# EAGLE design msp430-cc2500_breakout (EAGLE 6.1)
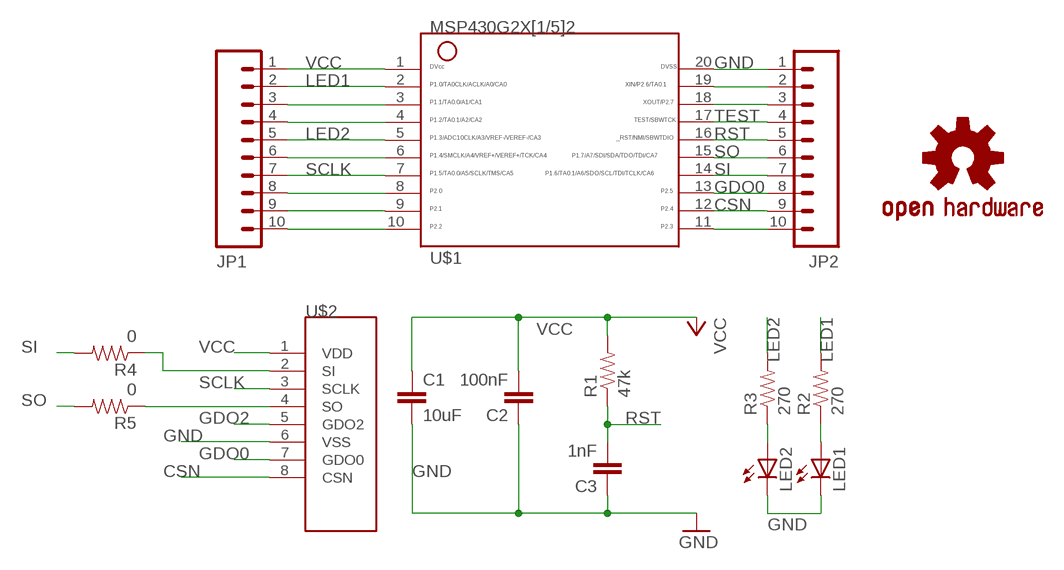
[diagram p0: schematic, sheet 1]

## Parts
C1  10uF  CAP0805  [0805]
C2  100nF  CAP0805  [0805]
C3  1nF  CAP0805  [0805]
JP1  M10"  [1X10]
JP2  M10"  [1X10]
LED1  LED1206  [LED-1206]
LED2  LED1206  [LED-1206]
R1  47k  RESISTOR0805-RES  [0805]
R2  270  RESISTOR0805-RES  [0805]
R3  270  RESISTOR0805-RES  [0805]
R4  0  RESISTOR0805-RES  [0805]
R5  0  RESISTOR0805-RES  [0805]
U$1  G2X[1/5]2---PW20  [PW20]
U$2  CC2500-MODULESMT  [CC2500-MODULE-SMT]
U$3  OSHW-LOGOL  [OSHW-LOGO-L]

## Nets
CSN: JP2.9 U$1.12 U$2.8(CSN)
GDO0: JP2.8 U$1.13 U$2.7(GDO0)
GDO2: U$2.5(GDO2)
GND: C1.2 C2.1 C3.1 JP2.1 LED1.C LED2.C U$1.20 U$2.6(VSS)
LED1: JP1.2 R2.2 U$1.2
LED2: JP1.5 R3.2 U$1.5
N$1: LED1.A R2.1
N$2: JP1.3 U$1.3
N$3: JP1.4 U$1.4
N$4: JP1.6 U$1.6
N$5: LED2.A R3.1
N$6: JP1.8 U$1.8
N$7: JP1.9 U$1.9
N$8: JP1.10 U$1.10
N$9: JP2.2 U$1.19
N$10: JP2.3 U$1.18
N$11: JP2.10 U$1.11
N$12: R4.1 U$2.2(SI)
N$13: R5.1 U$2.4(SO)
RST: C3.2 JP2.5 R1.1 U$1.16
SCLK: JP1.7 U$1.7 U$2.3(SCLK)
SI: JP2.7 R4.2 U$1.14
SO: JP2.6 R5.2 U$1.15
TEST: JP2.4 U$1.17
VCC: C1.1 C2.2 JP1.1 R1.2 U$1.1 U$2.1(VDD)

## Library data of the parts
C1-C3 = SparkFun:CAP: Capacitor Standard 0603 ceramic capacitor, and 0.1" leaded capacitor.
JP1 JP2 = SparkFun:M10: Header 10 Standard 10-pin 0.1" header. Use with straight break away headers (SKU : PRT-00116), right angle break away headers (PRT-00553), swiss pins (PRT-00743), machine pins (PRT-00117), and female headers (PRT-00115).
LED1 LED2 = SparkFun:LED: LEDs Standard schematic elements and footprints for 5mm, 3mm, 1206, and 0603 sized LEDs. 5mm - Spark Fun Electronics SKU : COM-00529 (and others)
R1-R5 = SparkFun:RESISTOR: Resistor Basic schematic elements and footprints for 0603, 1206, and PTH resistors.
U$1 = TI_MSP430_v16:G2X[1/5]2---PW20: MSP430G2X[1/5]2 MSP430G2x52, MSP430G2x12 TSSOP (PW) 20 Pin Package http://focus.ti.com/docs/prod/folders/print/msp430g2452.html
U$2 = alvaro:CC2500-MODULE
U$3 = SparkFun:OSHW-LOGO: Open Source Hardware Logo This logo indicates the piece of hardware it is found on incorporates a OSHW license and/or adheres to the definition of open source hardware found here: http://freedomdefined.org/OSHW

## Board
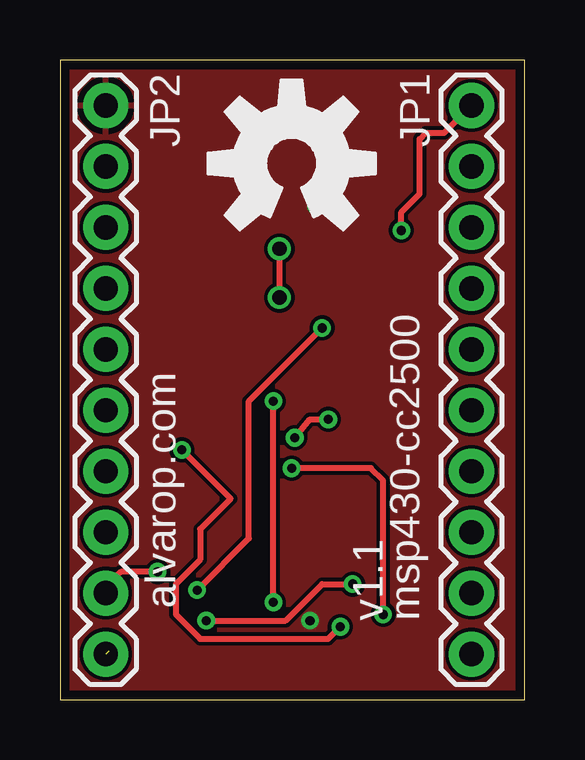
[diagram p1: board, top side]
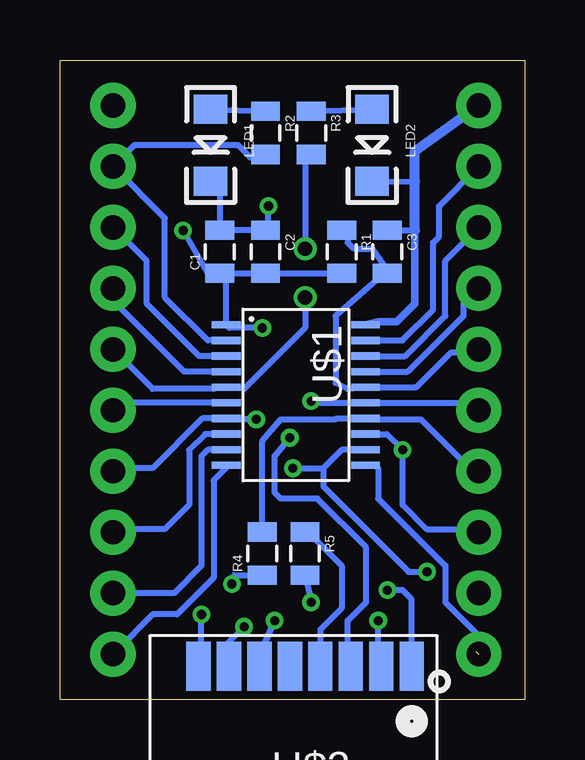
[diagram p2: board, bottom side, seen from below]

Size 19.36 x 26.66 mm. Coordinates in mm from the lower left corner, seen from the top.
Outline: 0,0 19.36,0 19.36,26.66 0,26.66 0,0
Copper layers (1*16): Top 0.0356mm / dielectric 1.5011mm / Bottom 0.0356mm
Design rules: minimum track width 6mil, minimum drill 13mil, track to track 6mil, track to pad 6mil, pad to pad 6mil, via to via 6mil, smd to smd 6mil, copper to edge 15mil, drill to drill 6mil, minimum pad ring 7mil, minimum via ring 7mil, stop-mask expansion 4mil, vias tented up to drill 0mil, thermal gap 10mil

### Footprints (pad centres in the part's own frame; a part is rotated, then mirrored left to right if it is on the bottom)
0805 = smd 0.8 x 1.2: 1 -0.9,0; 2 0.9,0
1X10 = drill 1.016 pad 1.88: 1 0,0; 2 2.54,0; 3 5.08,0; 4 7.62,0; 5 10.16,0; 6 12.7,0; 7 15.24,0; 8 17.78,0; 9 20.32,0; 10 22.86,0
LED-1206 = smd 1.2 x 1.4: A -1.5,0; C 1.5,0
PW20 = smd 0.3 x 1.2: 1 -2.925,-2.9; 2 -2.275,-2.9; 3 -1.625,-2.9; 4 -0.975,-2.9; 5 -0.325,-2.9; 6 0.325,-2.9; 7 0.975,-2.9; 8 1.625,-2.9; 9 2.275,-2.9; 10 2.925,-2.9; 11 2.925,2.9; 12 2.275,2.9; 13 1.625,2.9; 14 0.975,2.9; 15 0.325,2.9; 16 -0.325,2.9; 17 -0.975,2.9; 18 -1.625,2.9; 19 -2.275,2.9; 20 -2.925,2.9
CC2500-MODULE-SMT = smd 1.016 x 2.032: 1 -5.08,0.254; 2 -3.81,0.254; 3 -2.54,0.254; 4 -1.27,0.254; 5 0,0.254; 6 1.27,0.254; 7 2.54,0.254; 8 3.81,0.254

### Placement (x,y rotation side)
C1  12.7,18.67 90 bottom
C2  10.79,18.67 270 bottom
C3  5.71,18.67 270 bottom
JP1  17.14,24.77 270 top
JP2  1.91,24.77 270 top
LED1  13.08,23.11 270 bottom
LED2  6.35,23.11 270 bottom
R1  7.62,18.67 270 bottom
R2  10.79,23.62 270 bottom
R3  8.89,23.62 270 bottom
R4  10.92,6.1 90 bottom
R5  9.14,6.1 270 bottom
U$1  9.53,12.7 270 bottom
U$2  9.78,1.65 180 bottom
U$3  9.65,22.35 0 top

### Tracks (layer width: path | path; a pad name or v marks a point on that pad's centre or on a via)
CSN  (via drill 0.38)
  Top 0.254: v4.06,5.33 2.54,5.33 1.91,4.7 JP2.9 | v13.46,3.56 13.46,9.14 12.95,9.65 v9.65,9.65
  Bottom 0.254: U$1.12 6.64,10.41 7.62,10.41 8.38,9.65 | 8.38,9.65 8.38,8.89 4.83,5.33 v4.06,5.33 | U$2.8 13.46,1.52 v13.46,3.56 | v9.65,9.65 8.38,9.65
GDO0  (via drill 0.38)
  Top 0.254: v5.08,10.41 7.11,8.38 5.84,7.11 5.84,5.84 4.83,4.83 4.83,3.56 5.84,2.54 11.18,2.54 v11.68,3.05
  Bottom 0.254: U$1.13 5.74,11.07 v5.08,10.41 5.08,8.13 4.06,7.11 2.03,7.11 JP2.8 | v11.68,3.05 12.45,2.29 12.45,1.78 12.19,1.52 U$2.7
GND  (via drill 0.38)
  Bottom 0.254: LED2.C 4.57,21.59 | C3.1 4.57,19.56 | LED1.C 12.7,21.08 C1.2 C2.1 arc-90 10.67,19.7 v10.67,20.57 | U$2.6 11.18,1.52 v10.41,3.3
  Bottom 0.305: U$1.20 6.1,15.75 5.33,15.75 4.57,16.51 4.57,19.56
  Bottom 0.406: 4.57,19.56 4.57,21.59 4.57,22.86 JP2.1
  pour Top: 0,26.67 0,0 19.56,-0.25 19.3,26.67
LED1
  Bottom 0.254: U$1.2 13.2,14.97 14.99,16.76 14.99,20.07 JP1.2 16.26,23.11 11.94,23.11 11.43,22.61 11.18,22.61 R2.2
LED2  (via drill 0.6)
  Top 0.254: v9.14,18.8 v9.14,16.76
  Bottom 0.254: JP1.5 15.49,12.95 12.95,12.95 12.88,13.03 U$1.5 11.68,12.95 9.14,15.49 v9.14,16.76 | R3.2 9.14,22.35 v9.14,18.8
N$1
  Bottom 0.254: LED1.A R2.1
N$2
  Bottom 0.254: U$1.3 13.56,14.32 15.75,16.51 15.75,18.29 JP1.3
N$3
  Bottom 0.254: U$1.4 14.18,13.68 17.02,16.51 17.02,17.02 JP1.4
N$4
  Bottom 0.254: JP1.6 17.02,12.19 16.51,12.19 16.33,12.38 U$1.6
N$5
  Bottom 0.254: R3.1 LED2.A
N$6
  Bottom 0.254: U$1.8 13.31,11.07 13.97,10.41 13.97,8.13 14.99,7.11 17.02,7.11 JP1.8
N$7
  Bottom 0.254: U$1.9 12.45,10.41 13.21,10.41 13.46,10.16 13.46,5.59 14.61,4.45 JP1.9
N$8
  Bottom 0.254: U$1.10 12.43,9.67 12.95,9.14 12.95,5.08 14.48,3.56 15.49,3.56 17.02,2.03 JP1.10 17.27,1.78
N$9
  Bottom 0.254: U$1.19 5.09,14.97 3.81,16.26 3.81,19.05 3.56,19.3 3.56,20.57 JP2.2
N$10
  Bottom 0.254: U$1.18 4.98,14.32 3.3,16 3.3,18.29 JP2.3
N$11  (1 unrouted)
  Bottom 0.254: U$1.11 6.22,9.78 6.1,9.65 6.1,8.38 3.3,5.59 3.3,4.06 2.03,2.79 2.03,2.03
N$12  (via drill 0.38)
  Top 0.254: v6.1,3.3 9.4,3.3 10.92,4.83 v12.19,4.83
  Bottom 0.254: U$2.2 6.1,1.52 v6.1,3.3 | v12.19,4.83 12.19,5.08 12.08,5.2 R4.1
N$13
  Bottom 0.254: R5.1 9.03,7.11 9.14,7.11 7.62,5.59 7.62,3.81 8.51,2.92 U$2.4
RST
  Bottom 0.254: JP2.5 2.03,14.48 3.05,14.48 4.5,13.03 U$1.16 7.37,12.95 7.87,13.21 7.87,16 5.84,17.78 C3.2 5.71,17.91 6.35,18.8 7.11,18.8 7.37,19.05 7.37,19.57 R1.1
SCLK  (via drill 0.38)
  Top 0.254: v9.78,10.92 10.41,11.68 v11.18,11.68
  Bottom 0.254: JP1.7 17.02,9.65 15.49,9.65 13.42,11.72 U$1.7 12.43,11.71 12.45,11.68 v11.18,11.68 | U$2.3 7.37,1.52 7.37,3.3 6.6,4.06 6.6,6.35 8.64,8.38 10.16,8.38 10.41,8.64 10.41,10.16 v9.78,10.92
SI
  Bottom 0.254: R4.2 10.92,10.79 10.16,11.68 7.87,11.68 7.83,11.72 U$1.14 6.58,11.68 4.32,11.68 2.16,9.53 JP2.7
SO  (via drill 0.38)
  Top 0.254: v8.89,4.06 v8.89,12.45
  Bottom 0.254: JP2.6 2.21,12.38 U$1.15 8.96,12.38 v8.89,12.45 | R5.2 v8.89,4.06
TEST
  Bottom 0.254: U$1.17 4.87,13.68 2.54,16 2.54,16.51 JP2.4
VCC  (via drill 0.38)
  Top 0.254: v5.71,4.57 7.87,6.73 7.87,12.45 v10.92,15.49 | v14.22,19.56 14.22,20.32 14.99,21.08 14.99,23.37 15.24,23.62 16,23.62 JP1.1
  Bottom 0.254: C1.1 C2.2 R1.2 | U$2.1 4.7,4.19 5.08,4.57 v5.71,4.57 | v10.92,15.49 12.29,15.49 U$1.1 12.43,17.49 C1.1 | C1.1 13.2,17.77 v14.22,19.56

### Text on the board
tNames: alvarop.com | v1.1 | msp430-cc2500